# EAGLE schematic offical board (EAGLE 6.5.0)
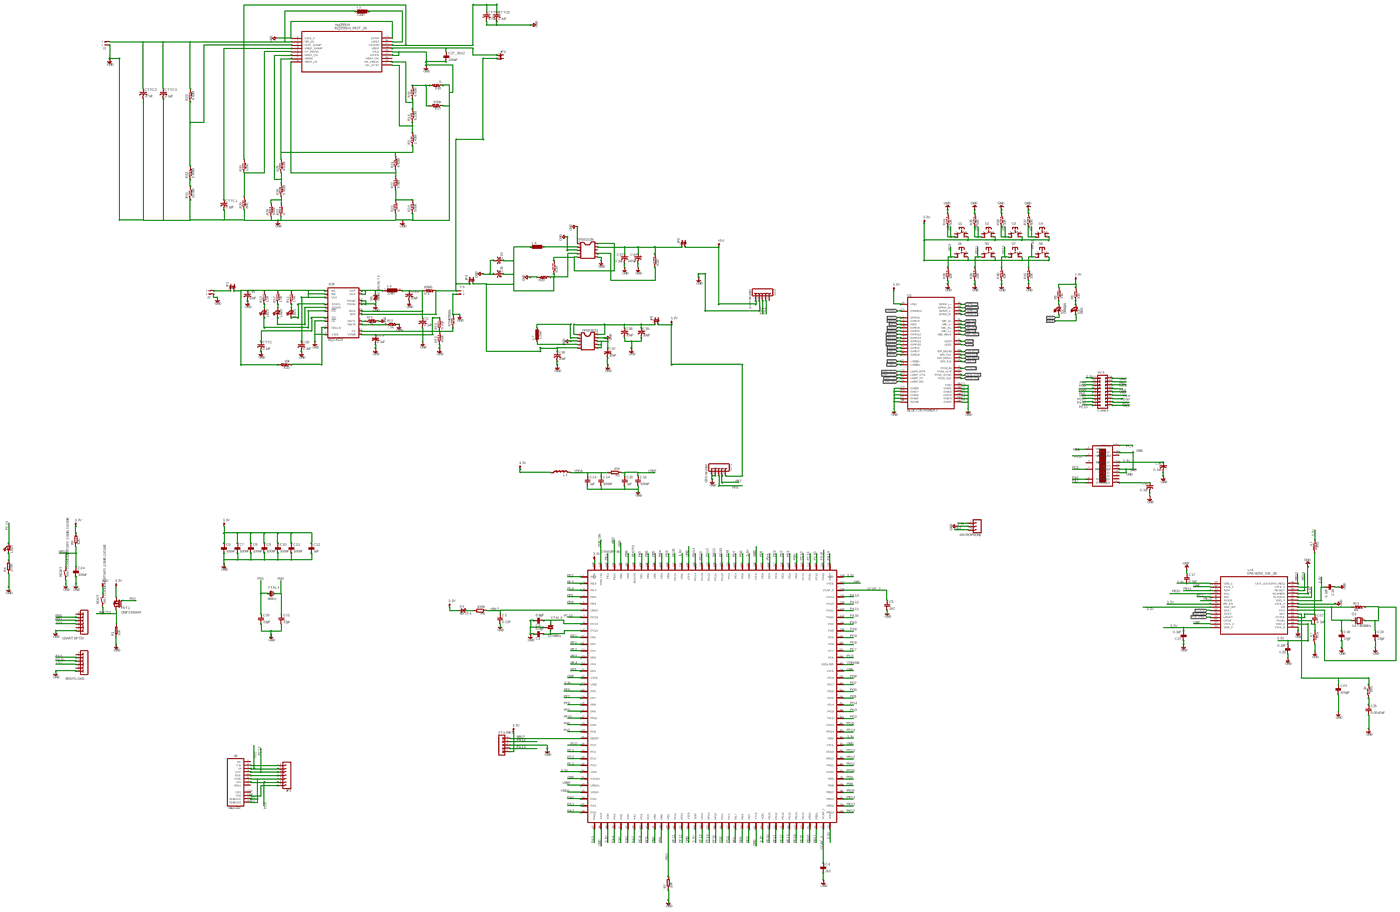
[diagram p0: schematic, sheet 1, overview]
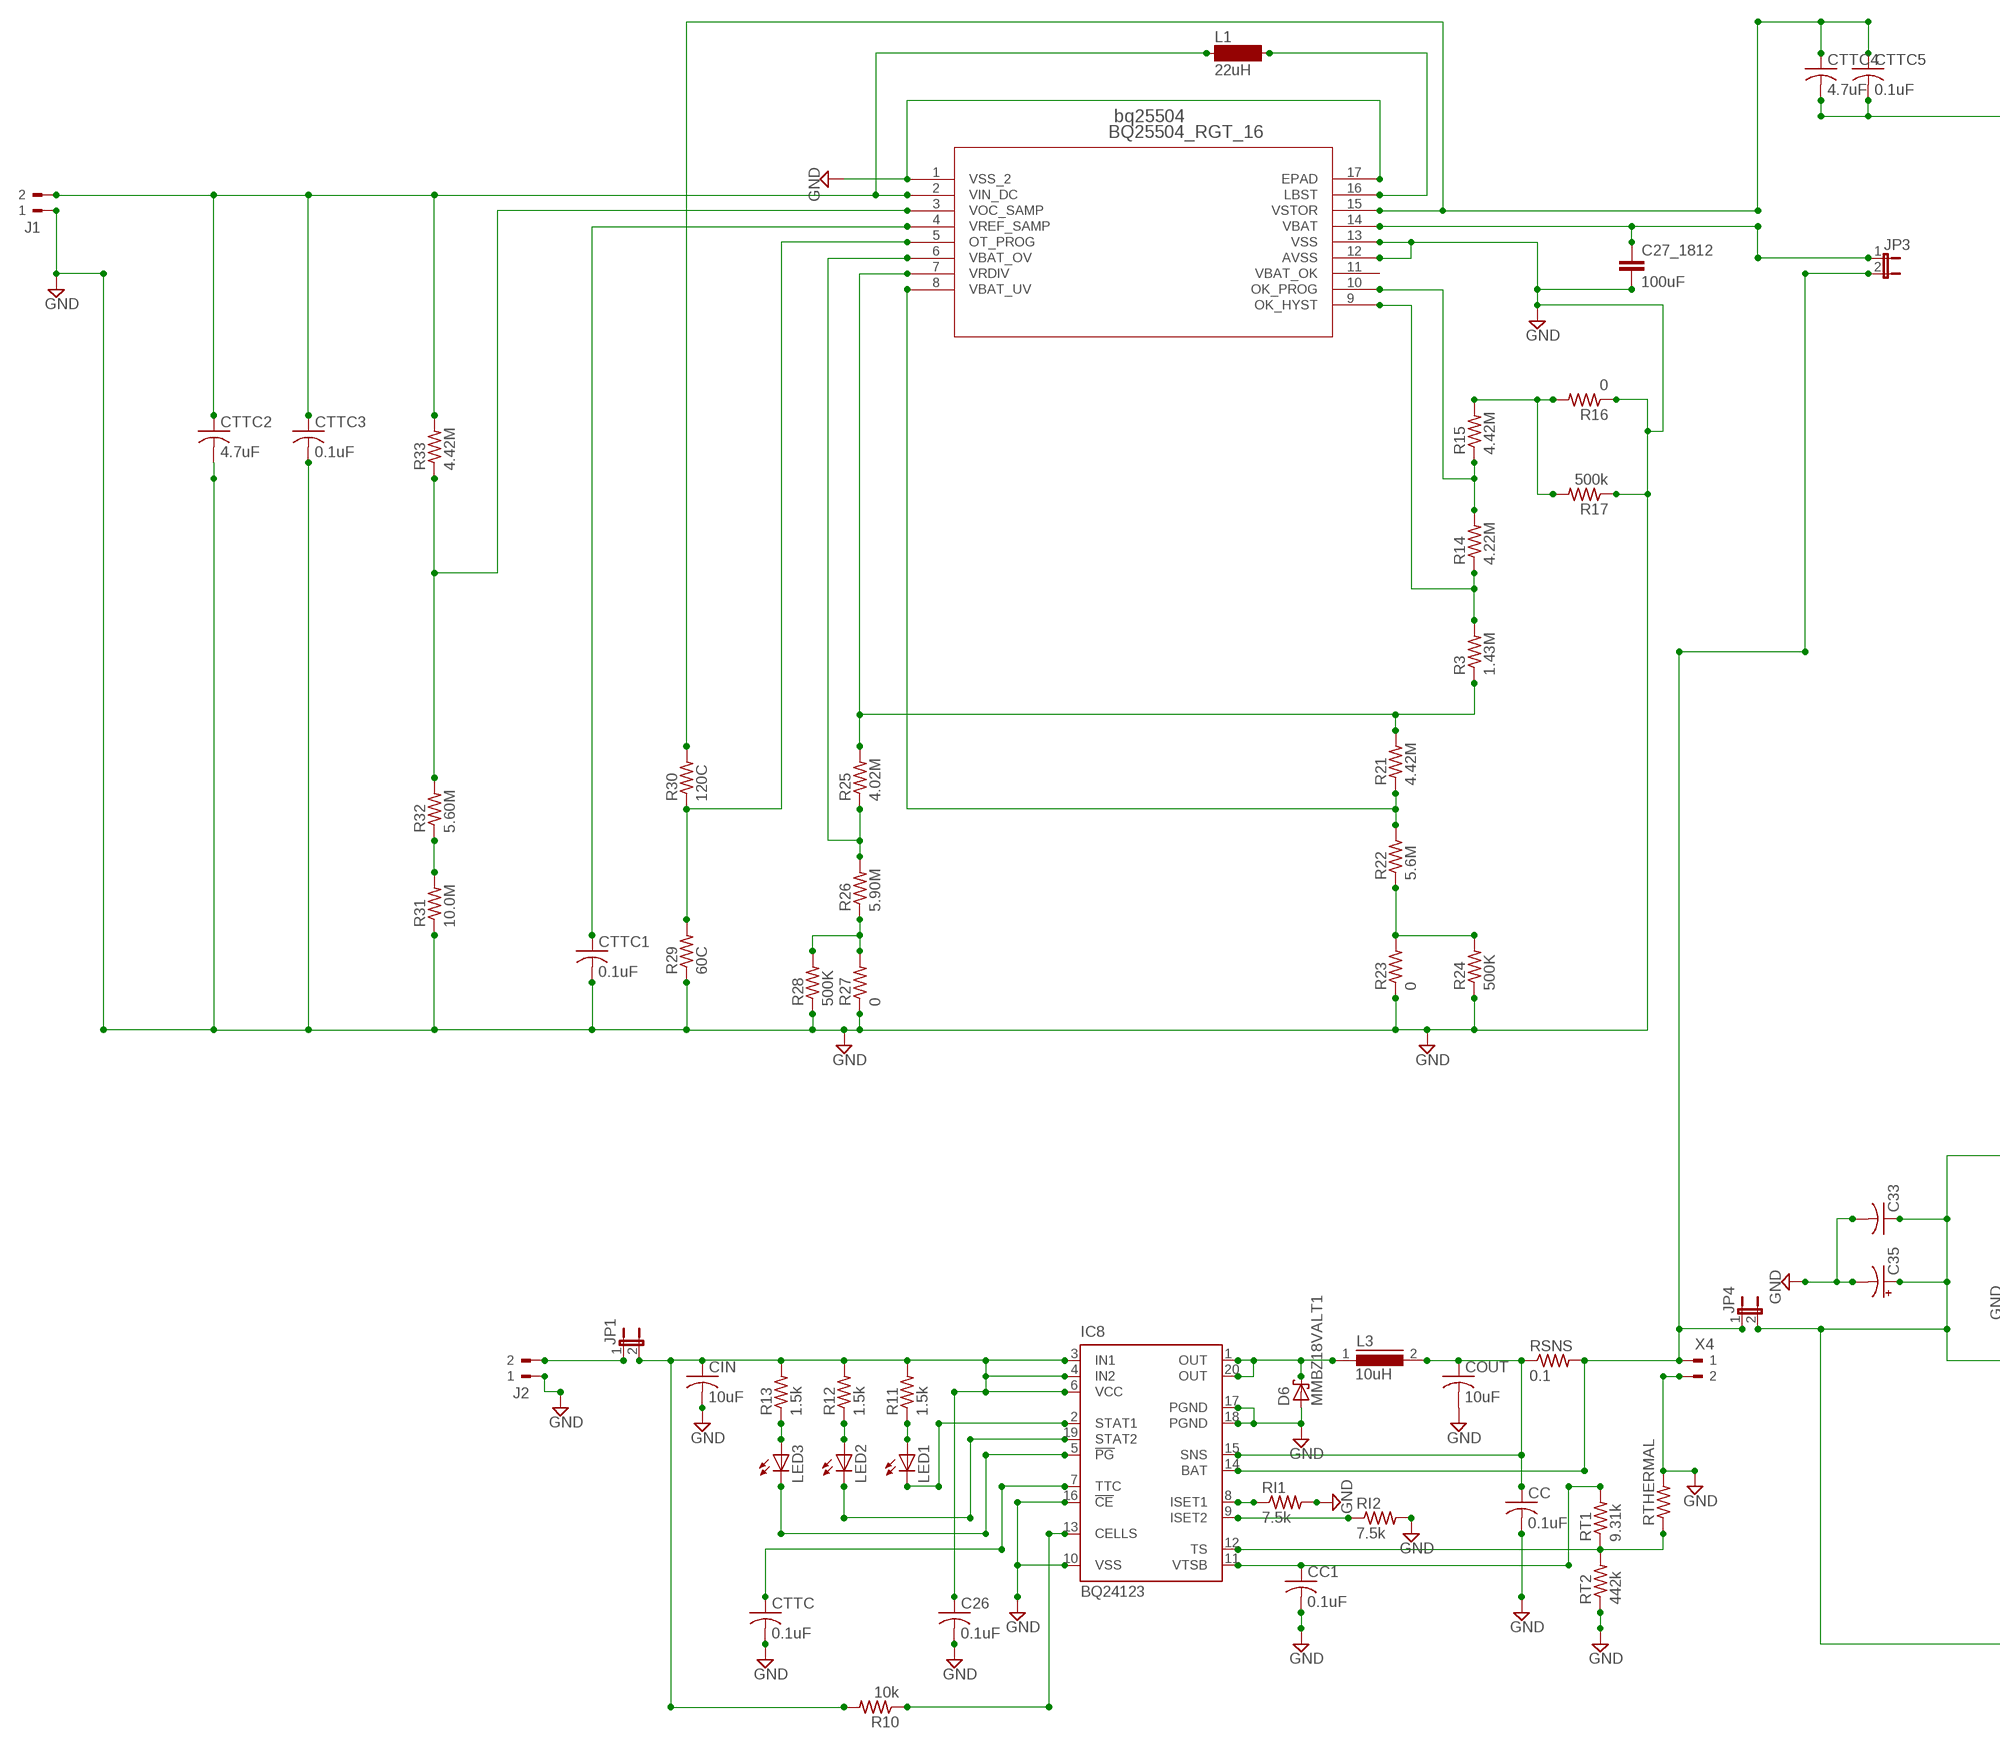
[diagram p1: schematic, sheet 1, part 1 of 5]
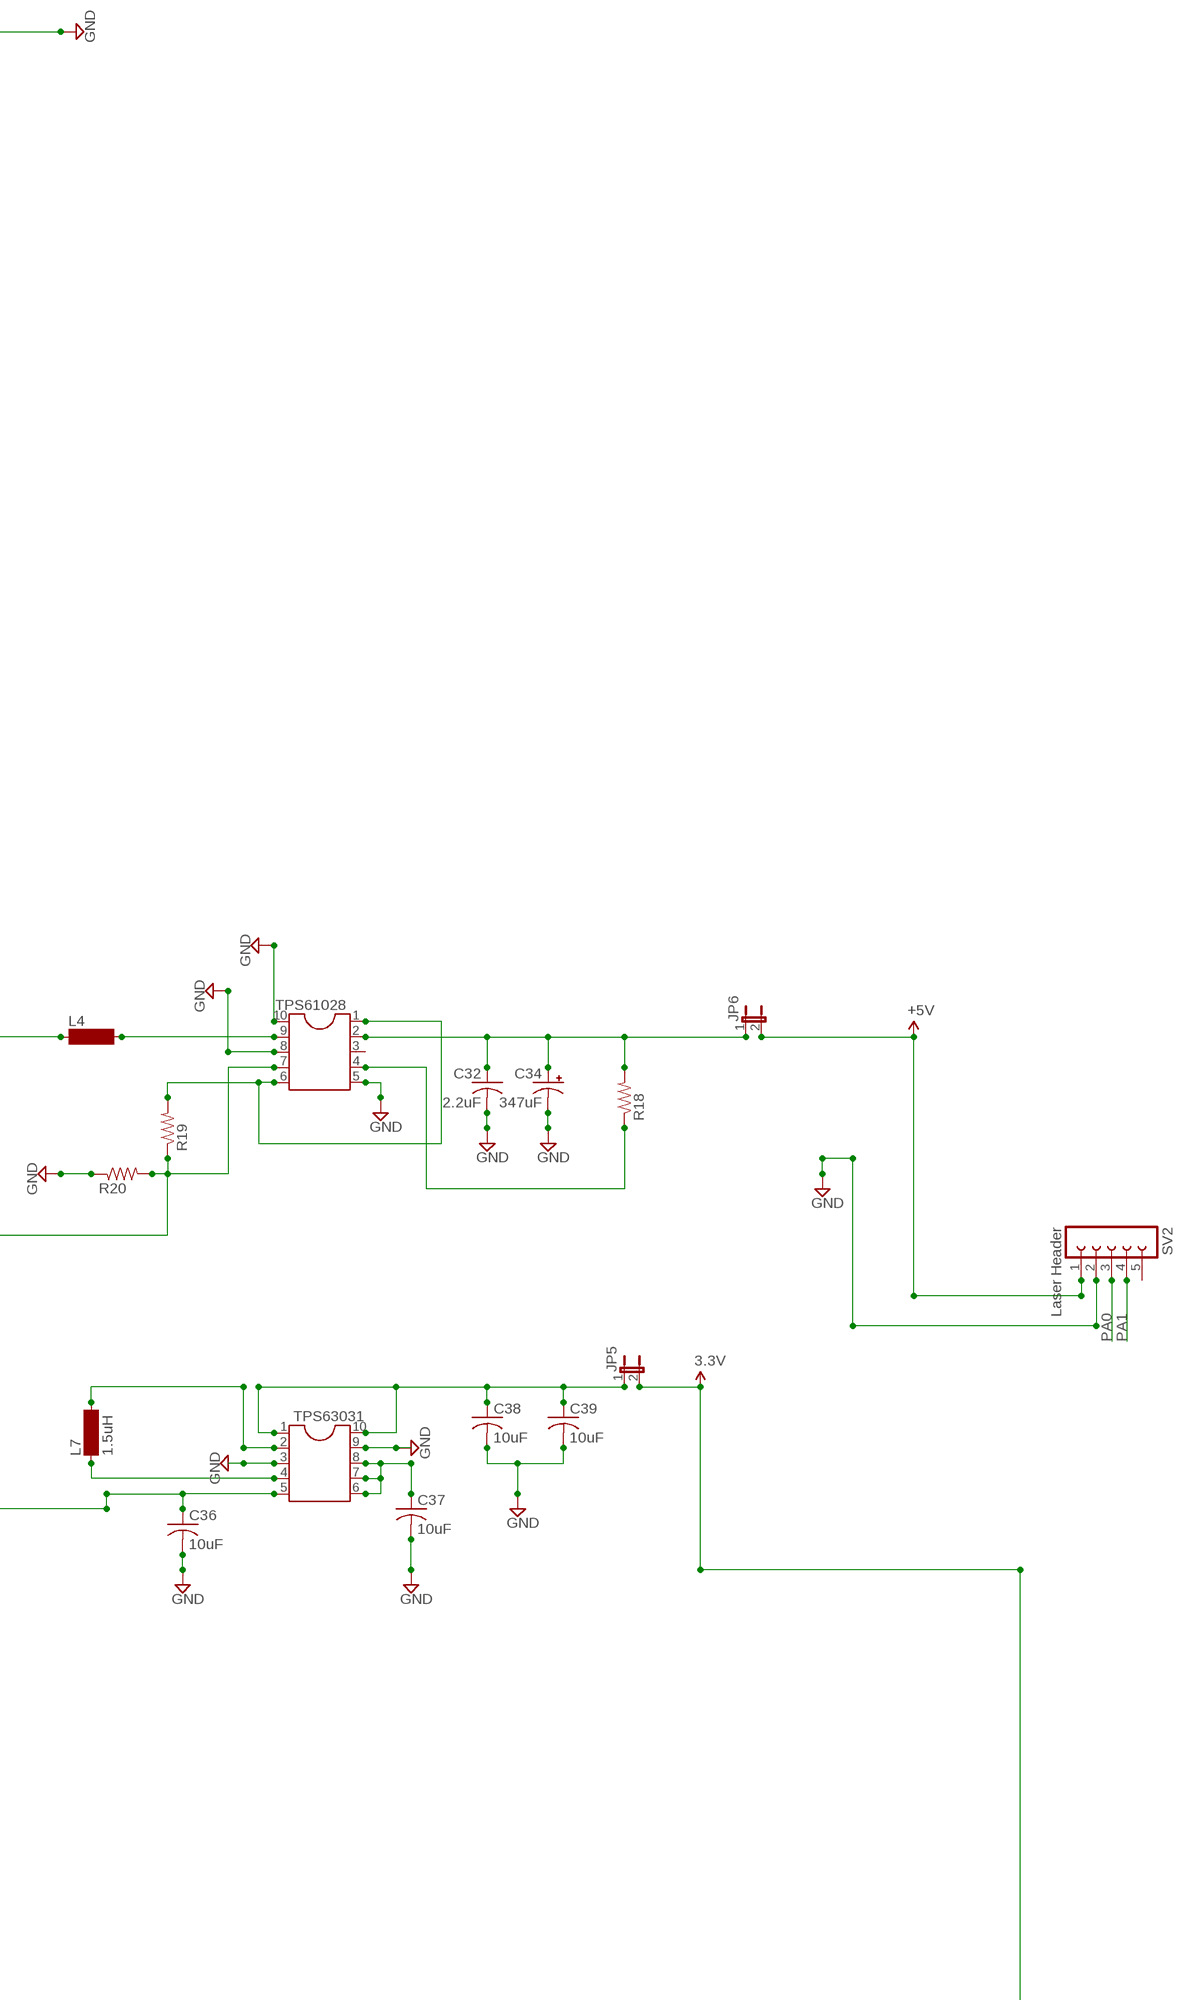
[diagram p2: schematic, sheet 1, part 2 of 5]
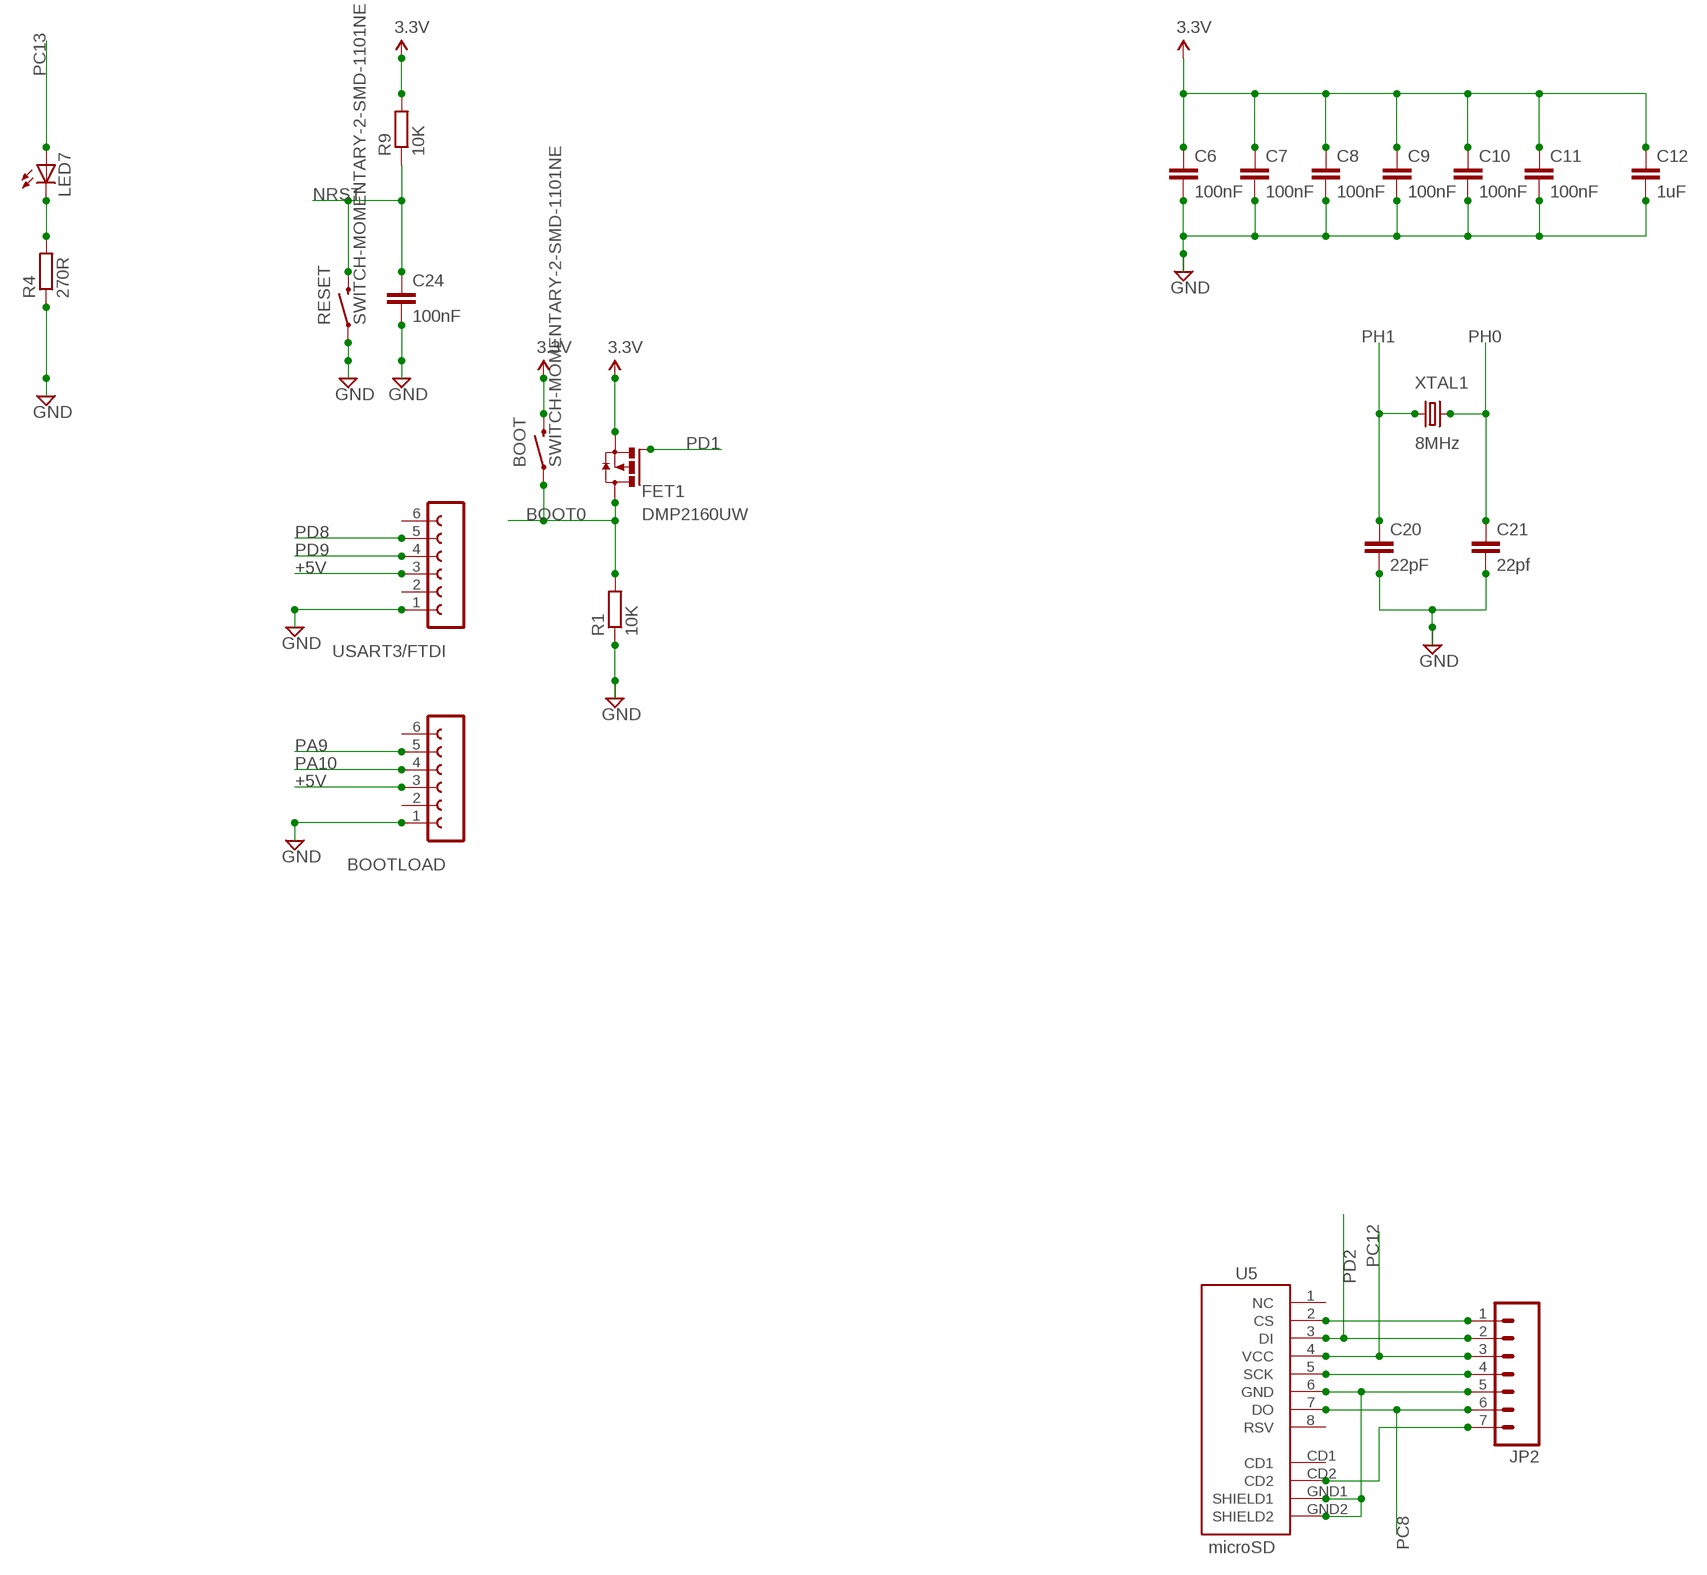
[diagram p3: schematic, sheet 1, part 3 of 5]
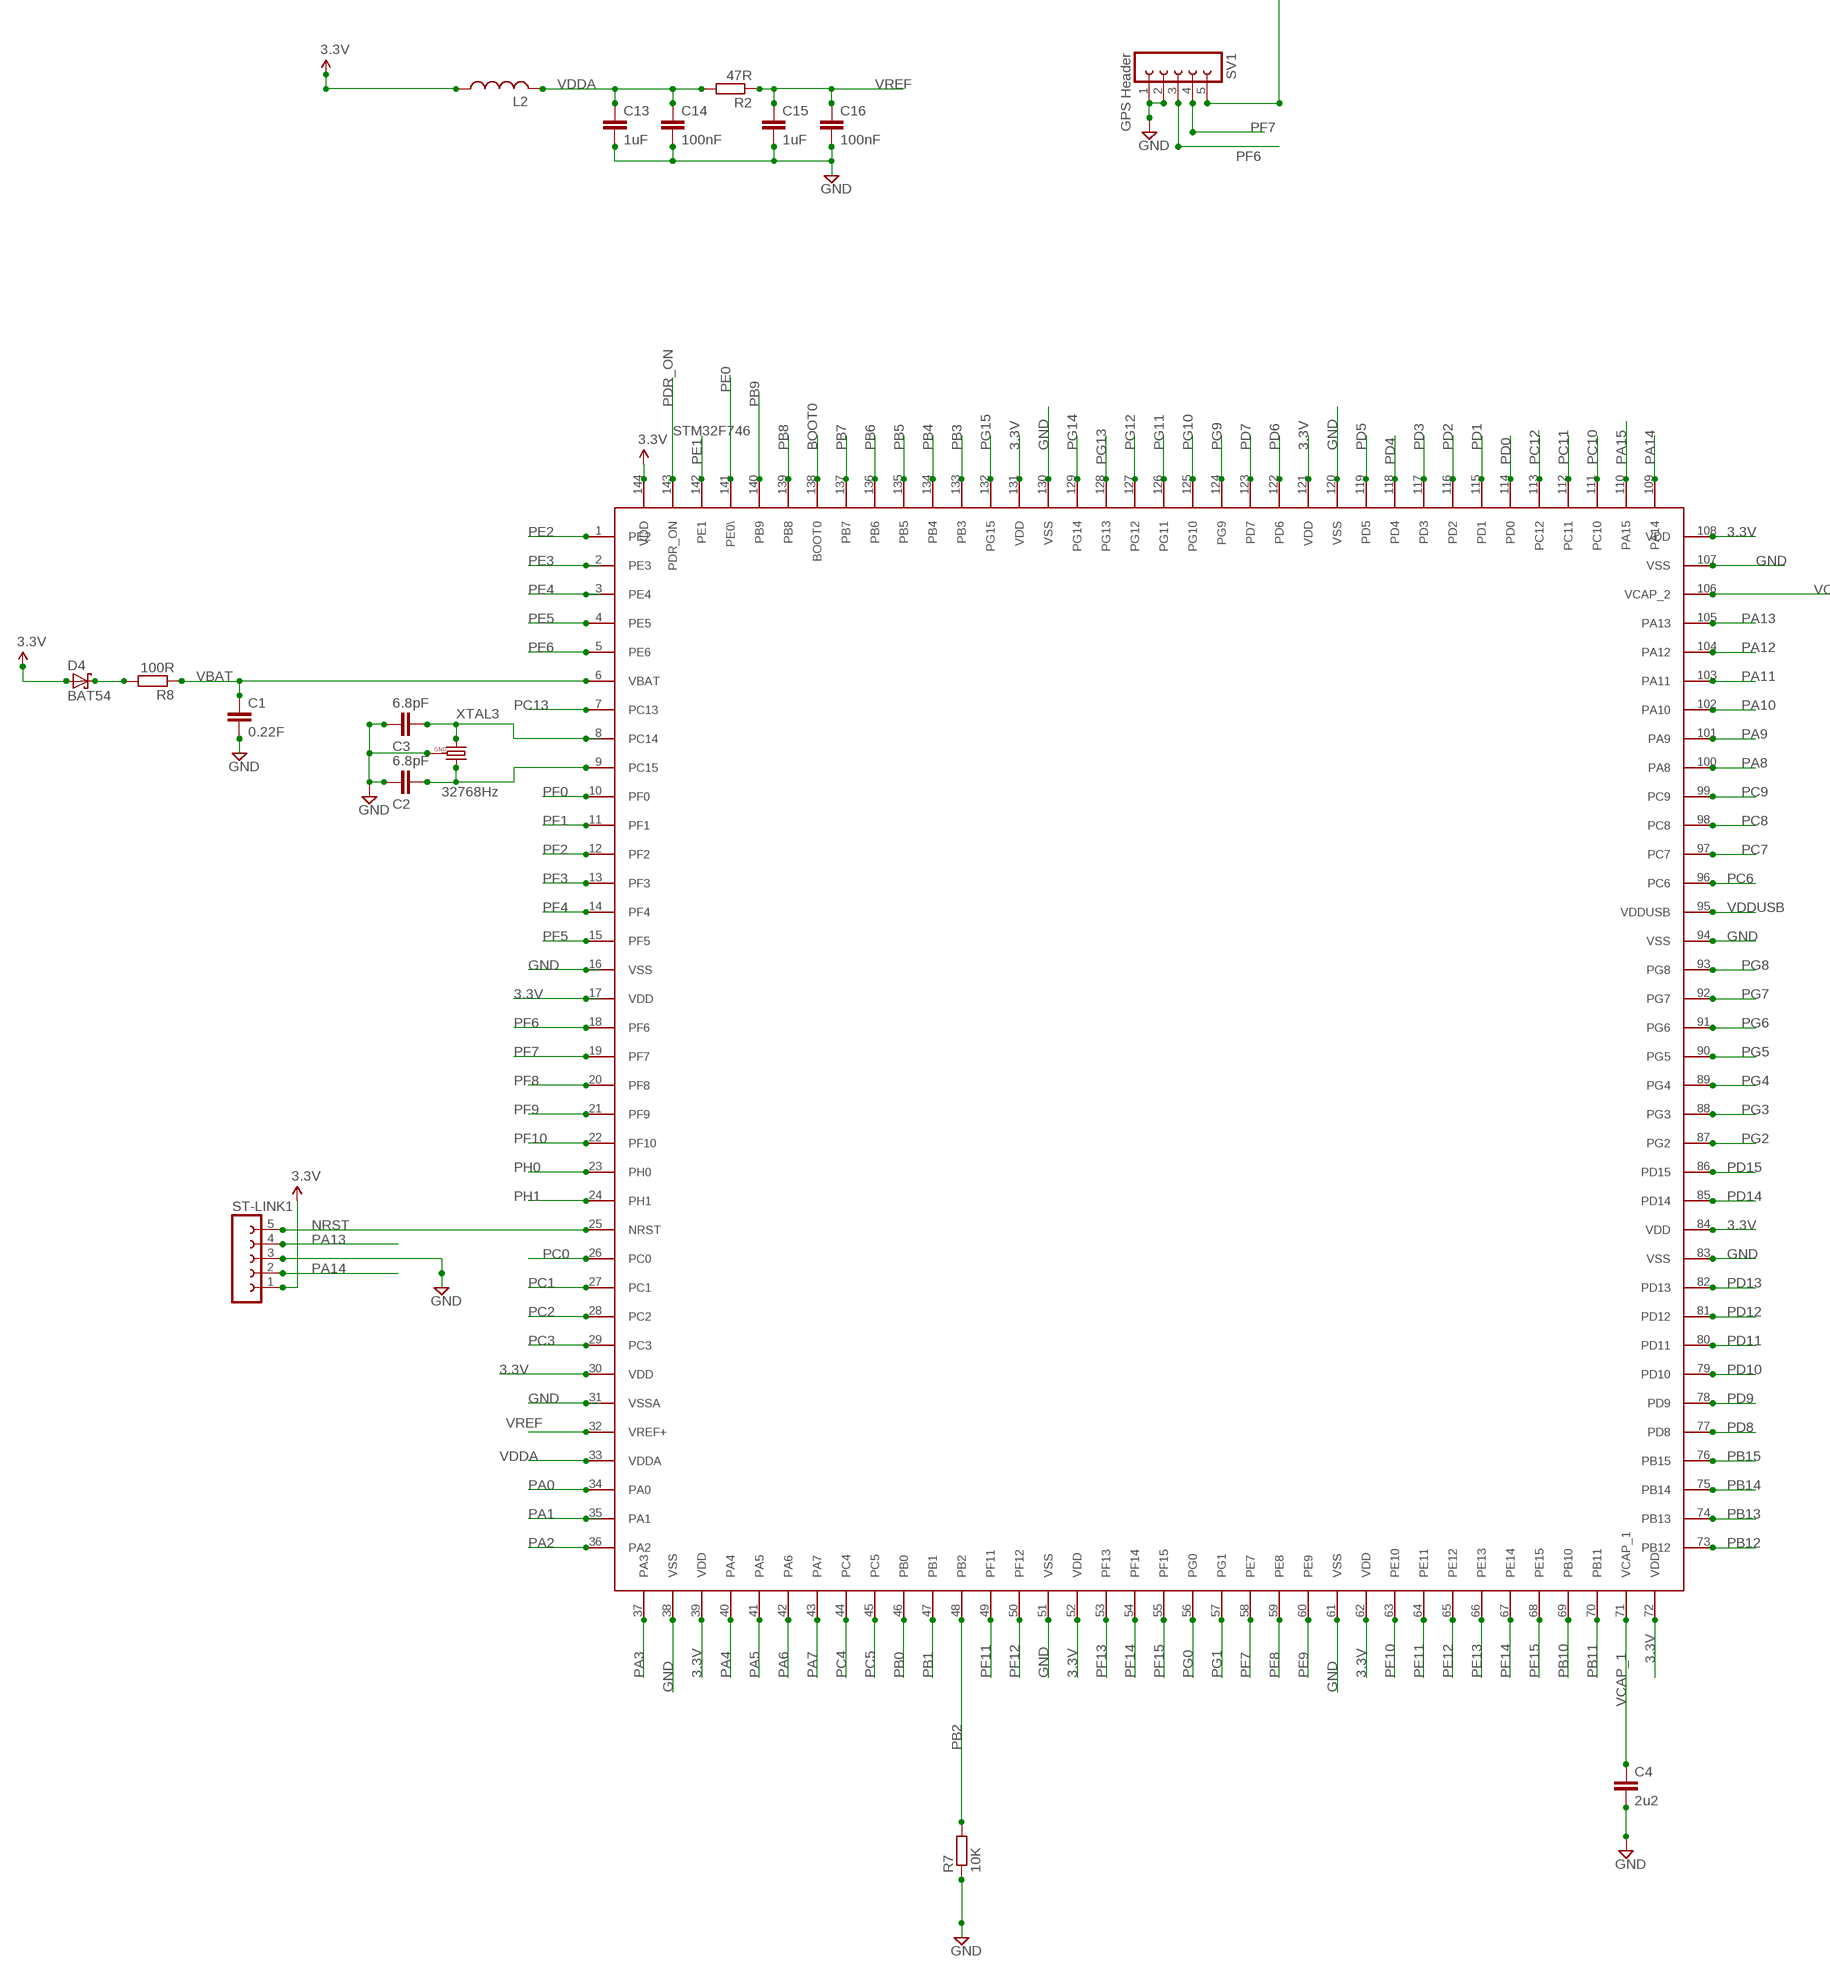
[diagram p4: schematic, sheet 1, part 4 of 5]
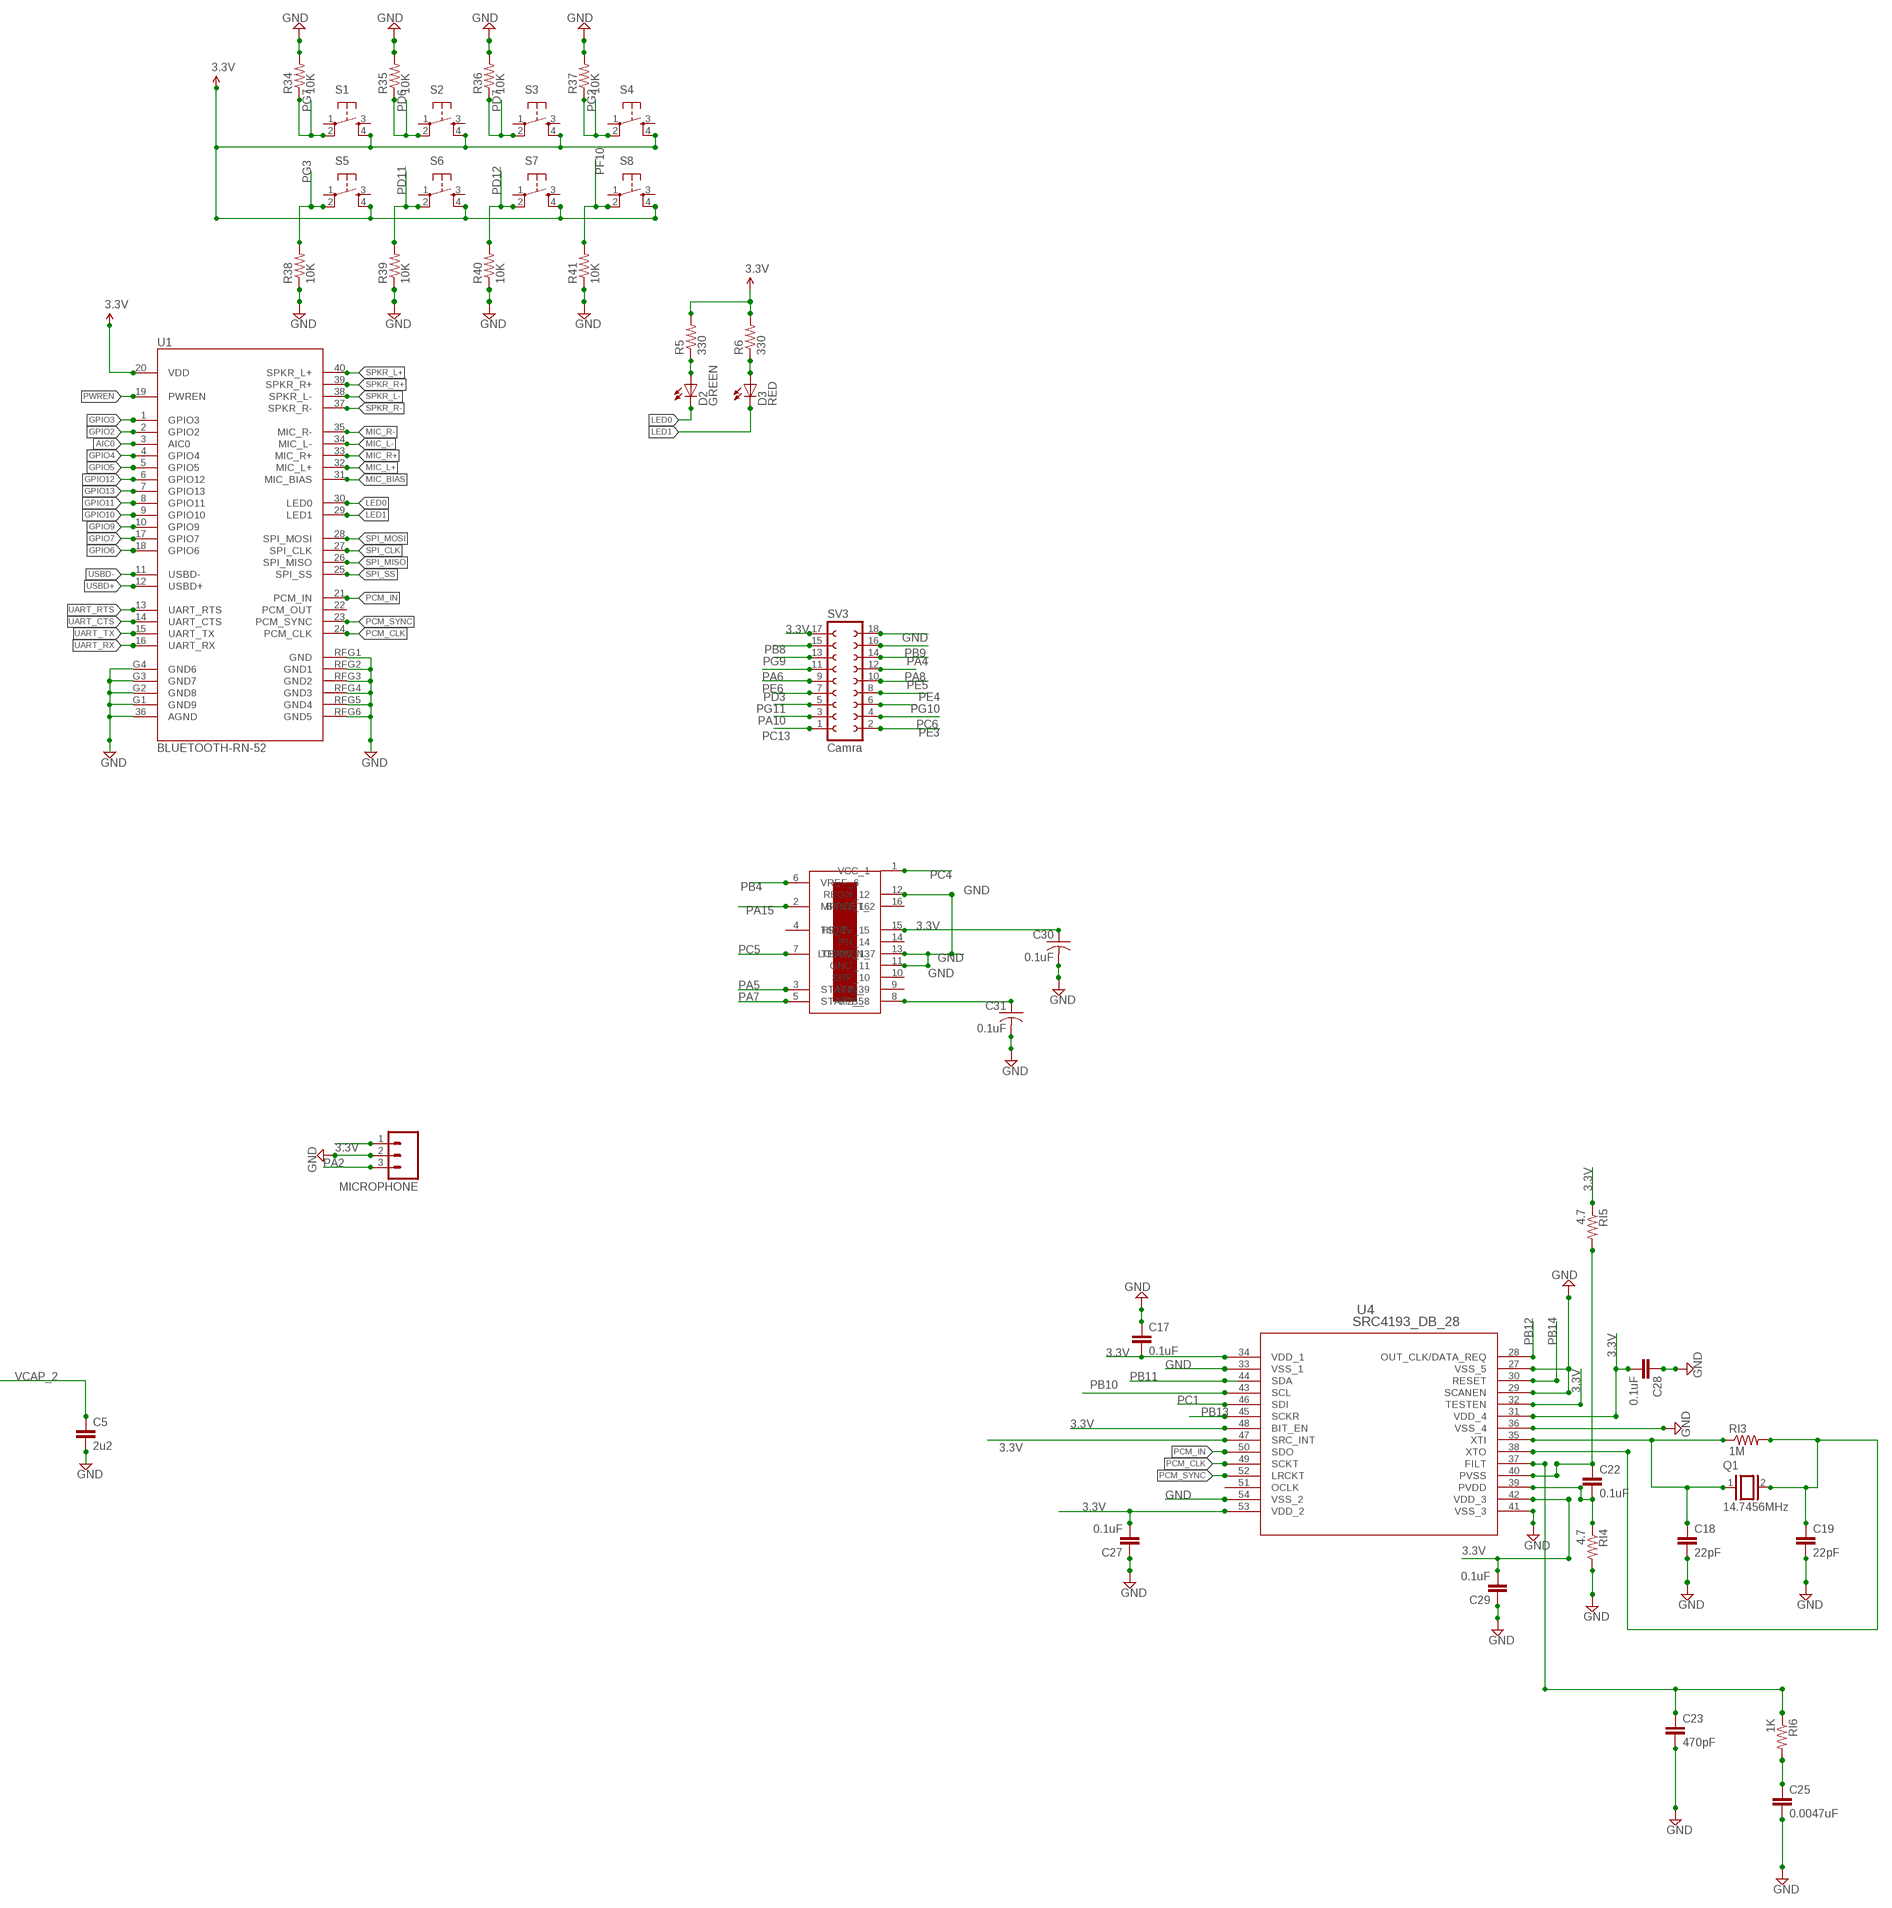
[diagram p5: schematic, sheet 1, part 5 of 5]

## Parts
BOOT  SWITCH-MOMENTARY-2-SMD-1101NE  [TACTILE-SWITCH-1101NE]
BOOTLOAD  FE06-1  [FE06]
C1  0.22F  C5/5  [C5B5]
C2  6.8pF  C-EUC0603  [C0603]
C3  6.8pF  C-EUC0603  [C0603]
C4  2u2  C-EUC0603  [C0603]
C5  2u2  C-EUC0603  [C0603]
C6  100nF  C-EUC0603  [C0603]
C7  100nF  C-EUC0603  [C0603]
C8  100nF  C-EUC0603  [C0603]
C9  100nF  C-EUC0603  [C0603]
C10  100nF  C-EUC0603  [C0603]
C11  100nF  C-EUC0603  [C0603]
C12  1uF  C-EUC0603  [C0603]
C13  1uF  C-EUC0603  [C0603]
C14  100nF  C-EUC0603  [C0603]
C15  1uF  C-EUC0603  [C0603]
C16  100nF  C-EUC0603  [C0603]
C17  0.1uF  C-EUC0603  [C0603]
C18  22pF  C-EUC0603  [C0603]
C19  22pF  C-EUC0603  [C0603]
C20  22pF  C-EUC0603  [C0603]
C21  22pf  C-EUC0603  [C0603]
C22  0.1uF  C-EUC0603  [C0603]
C23  470pF  C-EUC0603  [C0603]
C24  100nF  C-EUC0603  [C0603]
C25  0.0047uF  C-EUC0603  [C0603]
C26  0.1uF  C-USC0805  [C0805]
C27  0.1uF  C-EUC0603  [C0603]
C27_1812  100uF  C-EUC1812  [C1812]
C28  0.1uF  C-EUC0603  [C0603]
C29  0.1uF  C-EUC0603  [C0603]
C30  0.1uF  C-USC0603  [C0603]
C31  0.1uF  C-USC0603  [C0603]
C32  2.2uF  C-USC0603  [C0603]
C33  C-USC0603  [C0603]
C34  347uF  CPOL-US150CLZ-0810  [150CLZ-0810]
C35  CPOL-US150CLZ-0810  [150CLZ-0810]
C36  10uF  C-USC0603  [C0603]
C37  10uF  C-USC0603  [C0603]
C38  10uF  C-USC0603  [C0603]
C39  10uF  C-USC0603  [C0603]
CC  0.1uF  C-USC0805  [C0805]
CC1  0.1uF  C-USC0805  [C0805]
CIN  10uF  C-USC0805  [C0805]
COUT  10uF  C-USC0805  [C0805]
CTTC  0.1uF  C-USC0805  [C0805]
CTTC1  0.1uF  C-USC0805  [C0805]
CTTC2  4.7uF  C-USC0805  [C0805]
CTTC3  0.1uF  C-USC0805  [C0805]
CTTC4  4.7uF  C-USC0805  [C0805]
CTTC5  0.1uF  C-USC0805  [C0805]
D2  GREEN  LED-GREEN0603  [LED-0603]
D3  RED  LED-RED0603  [LED-0603]
D4  BAT54  [SOT23]
D6  MMBZ18VALT1  1N5908  [C4111-15]
FET1  DMP2160UW  FDN360P  [SUPER-SOT3]
IC8  BQ24123  [QFN20_3,5X4,5]
J1  90-2  [90-2]
J2  90-2  [90-2]
JP1  JP1E  [JP1]
JP2  M07  [1X07]
JP3  JP1E  [JP1]
JP4  JP1E  [JP1]
JP5  JP1E  [JP1]
JP6  JP1E  [JP1]
L1  22uH  SM-1206  [SM-1206]
L2  RCL_L-USL0603  [RCL_L0603]
L3  10uH  DR73  [DR73]
L4  SM-1206  [SM-1206]
L7  1.5uH  SM-1206  [SM-1206]
LED1  SFH482  [SFH482]
LED2  SFH482  [SFH482]
LED3  SFH482  [SFH482]
LED7  LEDCHIP-LED0603  [CHIP-LED0603]
MICROPHONE  M03PTH  [1X03]
Q1  14.7456MHz  XTAL/S  [QS]
R1  10K  R-EU_R0603  [R0603]
R2  47R  R-EU_R0603  [R0603]
R3  1.43M  R-US_R0805  [R0805]
R4  270R  R-EU_R0603  [R0603]
R5  330  RESISTOR0603-RES  [0603-RES]
R6  330  RESISTOR0603-RES  [0603-RES]
R7  10K  R-EU_R0603  [R0603]
R8  100R  R-EU_R0603  [R0603]
R9  10K  R-EU_R0603  [R0603]
R10  10k  R-US_R0805  [R0805]
R11  1.5k  R-US_R0805  [R0805]
R12  1.5k  R-US_R0805  [R0805]
R13  1.5k  R-US_R0805  [R0805]
R14  4.22M  R-US_R0805  [R0805]
R15  4.42M  R-US_R0805  [R0805]
R16  0  R-US_R0805  [R0805]
R17  500k  R-US_R0805  [R0805]
R18  R-US_R0603  [R0603]
R19  R-US_R0603  [R0603]
R20  R-US_R0603  [R0603]
R21  4.42M  R-US_R0805  [R0805]
R22  5.6M  R-US_R0805  [R0805]
R23  0  R-US_R0805  [R0805]
R24  500K  R-US_R0805  [R0805]
R25  4.02M  R-US_R0805  [R0805]
R26  5.90M  R-US_R0805  [R0805]
R27  0  R-US_R0805  [R0805]
R28  500K  R-US_R0805  [R0805]
R29  60C  R-US_R0805  [R0805]
R30  120C  R-US_R0805  [R0805]
R31  10.0M  R-US_R0805  [R0805]
R32  5.60M  R-US_R0805  [R0805]
R33  4.42M  R-US_R0805  [R0805]
R34  10K  RESISTOR0603-RES  [0603-RES]
R35  10K  RESISTOR0603-RES  [0603-RES]
R36  10K  RESISTOR0603-RES  [0603-RES]
R37  10K  RESISTOR0603-RES  [0603-RES]
R38  10K  RESISTOR0603-RES  [0603-RES]
R39  10K  RESISTOR0603-RES  [0603-RES]
R40  10K  RESISTOR0603-RES  [0603-RES]
R41  10K  RESISTOR0603-RES  [0603-RES]
RESET  SWITCH-MOMENTARY-2-SMD-1101NE  [TACTILE-SWITCH-1101NE]
RI1  7.5k  R-US_R0805  [R0805]
RI2  7.5k  R-US_R0805  [R0805]
RI3  1M  R-US_R0805  [R0805]
RI4  4.7  R-US_R0805  [R0805]
RI5  4.7  R-US_R0805  [R0805]
RI6  1K  R-US_R0805  [R0805]
RSNS  0.1  R-US_R1206  [R1206]
RT1  9.31k  R-US_R0805  [R0805]
RT2  442k  R-US_R0805  [R0805]
RTHERMAL  R-US_R0805  [R0805]
S1  TAC_SWITCHSMD  [TACTILE_SWITCH_SMD]
S2  TAC_SWITCHSMD  [TACTILE_SWITCH_SMD]
S3  TAC_SWITCHSMD  [TACTILE_SWITCH_SMD]
S4  TAC_SWITCHSMD  [TACTILE_SWITCH_SMD]
S5  TAC_SWITCHSMD  [TACTILE_SWITCH_SMD]
S6  TAC_SWITCHSMD  [TACTILE_SWITCH_SMD]
S7  TAC_SWITCHSMD  [TACTILE_SWITCH_SMD]
S8  TAC_SWITCHSMD  [TACTILE_SWITCH_SMD]
ST-LINK1  FE05-1  [FE05-1]
SV1  GPS Header  FE05-1  [FE05-1]
SV2  Laser Header  FE05-1  [FE05-1]
SV3  Camra  FE09-2  [FE09-2]
TPS61028  DIL10  [DIL10]
TPS63031  DIL10  [DIL10]
U1  BLUETOOTH-RN-52  [RN-52]
U3  BQ25504_RGT_16  [RGT16_1P7X1P7]
U4  SRC4193_DB_28  [DB28]
U5  microSD  USD-SOCKETSMD  [MICRO-SD-SOCKET-PP]
U$1  STM32F746  [QFN144]
U$2  QFN16  [QFN16]
USART3/FTDI  FE06-1  [FE06]
X4  90-2  [90-2]
XTAL1  8MHz  CRYSTALHC49U-V  [HC49U-V]
XTAL3  32768Hz  CRYSTAL_Q_GNDS  [CRYSTAL_TC26H_3_REPAIR_SMD_SMALL_PITCH]

## Nets
3.3V [thin_power]: BOOT.P$2 C6.1 C7.1 C8.1 C9.1 C10.1 C11.1 C12.1 C17.2 C27.2 C28.2 C29.2 C30.1 D4.1(A) FET1.2(S) JP5.2 L2.1 MICROPHONE.1 R5.2 R6.2 R9.2 RI5.1 S1.4 S2.4 S3.4 S4.4 S5.4 S6.4 S7.4 S8.4 ST-LINK1.1 SV1.5 SV3.17 U1.20(VDD) U4.31(VDD_4) U4.32(TESTEN) U4.34(VDD_1) U4.42(VDD_3) U4.47(SRC_INT) U4.48(BIT_EN) U4.53(VDD_2) U$1.17(VDD) U$1.30(VDD) U$1.39(VDD) U$1.52(VDD) U$1.62(VDD) U$1.72(VDD) U$1.84(VDD) U$1.108(VDD) U$1.121(VDD) U$1.131(VDD) U$1.144(VDD) U$2.15(HIDRV_15)
+5V [power usb]: BOOTLOAD.3 JP6.2 SV2.1 USART3/FTDI.3
AIC0: U1.3(AIC0)
BOOT0: BOOT.P$1 FET1.3(D) R1.2 U$1.138(BOOT0)
CD2: JP2.7 U5.CD2
CS1: JP2.1 U5.2(CS)
GND: BOOTLOAD.1 C1.2 C2.2 C3.2 C4.2 C5.2 C6.2 C7.2 C8.2 C9.2 C10.2 C11.2 C12.2 C13.2 C14.2 C15.2 C16.2 C17.1 C18.2 C19.2 C20.2 C21.2 C23.2 C24.2 C25.2 C26.2 C27.1 C27_1812.2 C28.1 C29.1 C30.2 C31.2 C32.2 C33.2 C34.- C35.- C36.2 C37.2 C38.2 C39.2 CC1.2 CC.2 CIN.2 COUT.2 CTTC1.2 CTTC2.2 CTTC3.2 CTTC4.2 CTTC5.2 CTTC.2 D6.A IC8.10(VSS) IC8.16(!CE) IC8.17(PGND) IC8.18(PGND) J1.1 J2.1 MICROPHONE.2 R1.1 R4.1 R7.1 R16.1 R17.1 R20.1 R23.1 R24.1 R27.1 R28.1 R29.1 R31.1 R34.2 R35.2 R36.2 R37.2 R38.1 R39.1 R40.1 R41.1 RESET.P$1 RI1.2 RI2.2 RI4.2 RT2.1 RTHERMAL.2 ST-LINK1.3 SV1.1 SV1.2 SV2.2 SV3.18 TPS61028.5 TPS61028.8 TPS61028.10 TPS63031.3 TPS63031.9 U1.36(AGND) U1.G1(GND9) U1.G2(GND8) U1.G3(GND7) U1.G4(GND6) U1.RFG1(GND) U1.RFG2(GND1) U1.RFG3(GND2) U1.RFG4(GND3) U1.RFG5(GND4) U1.RFG6(GND5) U3.1(VSS_2) U3.12(AVSS) U3.13(VSS) U3.17(EPAD) U4.27(VSS_5) U4.29(SCANEN) U4.33(VSS_1) U4.36(VSS_4) U4.41(VSS_3) U4.54(VSS_2) U$1.16(VSS) U$1.31(VSSA) U$1.38(VSS) U$1.51(VSS) U$1.61(VSS) U$1.83(VSS) U$1.94(VSS) U$1.107(VSS) U$1.120(VSS) U$1.130(VSS) U$2.11(GND_11) U$2.12(REGN_12) U$2.13(LODRV_13) USART3/FTDI.1 X4.2 XTAL3.GND
GND2: JP2.5 U5.6(GND) U5.GND1(SHIELD1) U5.GND2(SHIELD2)
GPIO2: U1.2(GPIO2)
GPIO3: U1.1(GPIO3)
GPIO4: U1.4(GPIO4)
GPIO5: U1.5(GPIO5)
GPIO6: U1.18(GPIO6)
GPIO7: U1.17(GPIO7)
GPIO9: U1.10(GPIO9)
GPIO10: U1.9(GPIO10)
GPIO11: U1.8(GPIO11)
GPIO12: U1.6(GPIO12)
GPIO13: U1.7(GPIO13)
LED0: D2.C U1.30(LED0)
LED1: D3.C U1.29(LED1)
MIC_BIAS: U1.31(MIC_BIAS)
MIC_L+: U1.32(MIC_L+)
MIC_L-: U1.34(MIC_L-)
MIC_R+: U1.33(MIC_R+)
MIC_R-: U1.35(MIC_R-)
N$1: D3.A R6.1
N$2: D2.A R5.1
N$3: D4.3(C) R8.2
N$4: C33.1 C35.+ C36.1 JP4.2 L4.1 R19.1 R20.2 TPS61028.7 TPS63031.5
N$5: C18.1 Q1.1 RI3.1 U4.35(XTI)
N$6: D6.C IC8.1(OUT) IC8.20(OUT) L3.1
N$7: C23.1 RI6.1 U4.37(FILT)
N$8 [power usb]: J2.2 JP1.1
N$9: C19.1 Q1.2 RI3.2 U4.38(XTO)
N$10: CTTC2.1 CTTC3.1 J1.2 L1.1 R33.2 U3.2(VIN_DC)
N$11: C25.1 RI6.2
N$12: CC.1 COUT.1 IC8.15(SNS) L3.2 RSNS.1
N$13: C22.2 RI4.1 U4.39(PVDD)
N$14: C22.1 RI5.2 U4.40(PVSS)
N$15: C27_1812.1 JP3.1 U3.14(VBAT)
N$16: CTTC4.1 CTTC5.1 R30.2 U3.15(VSTOR)
N$17: IC8.14(BAT) JP3.2 JP4.1 RSNS.2 X4.1
N$18: IC8.8(ISET1) RI1.1
N$19: R14.2 R15.1 U3.10(OK_PROG)
N$20: R3.2 R14.1 U3.9(OK_HYST)
N$21: IC8.9(ISET2) RI2.1
N$22: IC8.12(TS) RT1.1 RT2.2 RTHERMAL.1
N$23: CC1.1 IC8.11(VTSB) RT1.2
N$24: LED3.A R13.1
N$25: LED2.A R12.1
N$26: LED1.A R11.1
N$27: IC8.2(STAT1) LED1.K(C)
N$28: IC8.19(STAT2) LED2.K(C)
N$29: IC8.5(!PG) LED3.K(C)
N$30: CTTC.1 IC8.7(TTC)
N$31: IC8.13(CELLS) R10.1
N$32: R15.2 R16.2 R17.2
N$33: R3.1 R21.2 R25.2 U3.7(VRDIV)
N$34: R21.1 R22.2 U3.8(VBAT_UV)
N$35: R22.1 R23.2 R24.2
N$36 [thin_power]: C38.1 C39.1 JP5.1 TPS63031.1 TPS63031.10
N$37: C26.1 CIN.1 IC8.3(IN1) IC8.4(IN2) IC8.6(VCC) JP1.2 R10.2 R11.2 R12.2 R13.2
N$38: C31.1 U$2.8(VFB_8)
N$39: L1.2 U3.16(LBST)
N$40: R25.1 R26.2 U3.6(VBAT_OV)
N$41: R26.1 R27.2 R28.2
N$42: CTTC1.1 U3.4(VREF_SAMP)
N$43 [power usb]: C32.1 C34.+ JP6.1 R18.2 TPS61028.2
N$44: R18.1 TPS61028.4
N$45: R19.2 TPS61028.1 TPS61028.6
N$46: R29.2 R30.1 U3.5(OT_PROG)
N$47: L4.2 TPS61028.9
N$49: L7.2 TPS63031.2
N$50: L7.1 TPS63031.4
N$51: C37.1 TPS63031.6 TPS63031.7 TPS63031.8
N$52: R31.2 R32.1
N$53: R32.2 R33.1 U3.3(VOC_SAMP)
N$57: LED7.C R4.2
NRST: C24.1 R9.1 RESET.P$2 ST-LINK1.5 U$1.25(NRST)
PA0: SV2.3 U$1.34(PA0)
PA1: SV2.4 U$1.35(PA1)
PA2: MICROPHONE.3 U$1.36(PA2)
PA3: U$1.37(PA3)
PA4: SV3.14 U$1.40(PA4)
PA5: U$1.41(PA5) U$2.3(STAT1_3)
PA6: SV3.11 U$1.42(PA6)
PA7: U$1.43(PA7) U$2.5(STAT2_5)
PA8: SV3.12 U$1.100(PA8)
PA9: BOOTLOAD.5 U$1.101(PA9)
PA10: BOOTLOAD.4 SV3.3 U$1.102(PA10)
PA11: U$1.103(PA11)
PA12: U$1.104(PA12)
PA13: ST-LINK1.4 U$1.105(PA13)
PA14: ST-LINK1.2 U$1.109(PA14)
PA15: U$1.110(PA15) U$2.2(MPPSET_2)
PB0: U$1.46(PB0)
PB1: U$1.47(PB1)
PB2: R7.2 U$1.48(PB2)
PB3: U$1.133(PB3)
PB4: U$1.134(PB4) U$2.6(VREF_6)
PB5: U$1.135(PB5)
PB6: U$1.136(PB6)
PB7: U$1.137(PB7)
PB8: SV3.15 U$1.139(PB8)
PB9: SV3.16 U$1.140(PB9)
PB10: U4.43(SCL) U$1.69(PB10)
PB11: U4.44(SDA) U$1.70(PB11)
PB12: U4.28(OUT_CLK/DATA_REQ) U$1.73(PB12)
PB13: U4.45(SCKR) U$1.74(PB13)
PB14: U4.30(RESET) U$1.75(PB14)
PB15: U$1.76(PB15)
PC0: U$1.26(PC0)
PC1: U4.46(SDI) U$1.27(PC1)
PC2: U$1.28(PC2)
PC3: U$1.29(PC3)
PC4: U$1.44(PC4) U$2.1(VCC_1)
PC5: U$1.45(PC5) U$2.7(TERMEN_7)
PC6: SV3.4 U$1.96(PC6)
PC7: U$1.97(PC7)
PC8: JP2.6 U5.7(DO) U$1.98(PC8)
PC9: U$1.99(PC9)
PC10: U$1.111(PC10)
PC11: U$1.112(PC11)
PC12: JP2.3 U5.4(VCC) U$1.113(PC12)
PC13: LED7.A SV3.1 U$1.7(PC13)
PC14: C3.1 U$1.8(PC14) XTAL3.1
PC15: C2.1 U$1.9(PC15) XTAL3.2
PCM_CLK: U1.24(PCM_CLK) U4.49(SCKT)
PCM_IN: U1.21(PCM_IN) U4.50(SDO)
PCM_SYNC: U1.23(PCM_SYNC) U4.52(LRCKT)
PD0: U$1.114(PD0)
PD1: FET1.1(G) U$1.115(PD1)
PD2: JP2.2 U5.3(DI) U$1.116(PD2)
PD3: SV3.7 U$1.117(PD3)
PD4: U$1.118(PD4)
PD5: U$1.119(PD5)
PD6: R35.1 S2.2 U$1.122(PD6)
PD7: R36.1 S3.2 U$1.123(PD7)
PD8: U$1.77(PD8) USART3/FTDI.5
PD9: U$1.78(PD9) USART3/FTDI.4
PD10: U$1.79(PD10)
PD11: R39.2 S6.2 U$1.80(PD11)
PD12: R40.2 S7.2 U$1.81(PD12)
PD13: U$1.82(PD13)
PD14: U$1.85(PD14)
PD15: U$1.86(PD15)
PDR_ON: U$1.143(PDR_ON)
PE0: U$1.141(PE0\)
PE1: U$1.142(PE1)
PE2: U$1.1(PE2)
PE3: SV3.2 U$1.2(PE3)
PE4: SV3.8 U$1.3(PE4)
PE5: SV3.10 U$1.4(PE5)
PE6: SV3.9 U$1.5(PE6)
PE7: U$1.58(PE7)
PE8: U$1.59(PE8)
PE9: U$1.60(PE9)
PE10: U$1.63(PE10)
PE11: U$1.64(PE11)
PE12: U$1.65(PE12)
PE13: U$1.66(PE13)
PE14: U$1.67(PE14)
PE15: U$1.68(PE15)
PF0: U$1.10(PF0)
PF1: U$1.11(PF1)
PF2: U$1.12(PF2)
PF3: U$1.13(PF3)
PF4: U$1.14(PF4)
PF5: U$1.15(PF5)
PF6: SV1.3 U$1.18(PF6)
PF7: SV1.4 U$1.19(PF7)
PF8: U$1.20(PF8)
PF9: U$1.21(PF9)
PF10: R41.2 S8.2 U$1.22(PF10)
PF11: U$1.49(PF11)
PF12: U$1.50(PF12)
PF13: U$1.53(PF13)
PF14: U$1.54(PF14)
PF15: U$1.55(PF15)
PG0: U$1.56(PG0)
PG1: U$1.57(PG1)
PG2: R37.1 S4.2 U$1.87(PG2)
PG3: R38.2 S5.2 U$1.88(PG3)
PG4: U$1.89(PG4)
PG5: U$1.90(PG5)
PG6: U$1.91(PG6)
PG7: R34.1 S1.2 U$1.92(PG7)
PG8: U$1.93(PG8)
PG9: SV3.13 U$1.124(PG9)
PG10: SV3.6 U$1.125(PG10)
PG11: SV3.5 U$1.126(PG11)
PG12: U$1.127(PG12)
PG13: U$1.128(PG13)
PG14: U$1.129(PG14)
PG15: U$1.132(PG15)
PH0: C21.1 U$1.23(PH0) XTAL1.2
PH1: C20.1 U$1.24(PH1) XTAL1.1
PWREN: U1.19(PWREN)
SCK1: JP2.4 U5.5(SCK)
SPI_CLK: U1.27(SPI_CLK)
SPI_MISO: U1.26(SPI_MISO)
SPI_MOSI: U1.28(SPI_MOSI)
SPI_SS: U1.25(SPI_SS)
SPKR_L+: U1.40(SPKR_L+)
SPKR_L-: U1.38(SPKR_L-)
SPKR_R+: U1.39(SPKR_R+)
SPKR_R-: U1.37(SPKR_R-)
UART_CTS: U1.14(UART_CTS)
UART_RTS: U1.13(UART_RTS)
UART_RX: U1.16(UART_RX)
UART_TX: U1.15(UART_TX)
USBD+: U1.12(USBD+)
USBD-: U1.11(USBD-)
VBAT: C1.1 R8.1 U$1.6(VBAT)
VCAP_1: C4.1 U$1.71(VCAP_1)
VCAP_2: C5.1 U$1.106(VCAP_2)
VDDA: C13.1 C14.1 L2.2 R2.2 U$1.33(VDDA)
VDDUSB: U$1.95(VDDUSB)
VREF: C15.1 C16.1 R2.1 U$1.32(VREF+)
Unconnected: BOOTLOAD.2 BOOTLOAD.6 IC8.EXP IC8.EXP@1 IC8.EXP@2 IC8.EXP@3 IC8.EXP@4 IC8.EXP@5 IC8.EXP@6 IC8.EXP@7 IC8.EXP@8 IC8.EXP@9 IC8.EXP@10 IC8.EXP@11 IC8.EXP@12 S1.1 S1.3 S2.1 S2.3 S3.1 S3.3 S4.1 S4.3 S5.1 S5.3 S6.1 S6.3 S7.1 S7.3 S8.1 S8.3 SV2.5 TPS61028.3 U1.22(PCM_OUT) U3.11(VBAT_OK) U4.51(OCLK) U5.1(NC) U5.8(RSV) U5.CD1 U$2.4(TS_4) U$2.9(SRN_9) U$2.10(SRP_10) U$2.14(PH_14) U$2.16(BTST_16) USART3/FTDI.2 USART3/FTDI.6

## Library data of the parts
BOOT RESET = SparkFun-Electromechanical:SWITCH-MOMENTARY-2: Various NO switches- pushbuttons, reed, etc
BOOTLOAD USART3/FTDI = con-lsta:FE06-1: FEMALE HEADER; OC_FARNELL: unknown; OC_NEWARK: unknown
C1 = capacitor-wima:C: CAPACITOR naming: grid - package width
C2-C25 C27-C29 = rcl:C-EU: CAPACITOR, European symbol
C26 C30-C33 C36-C39 CC CC1 CIN COUT CTTC CTTC1-CTTC5 = resistor:C-US: CAPACITOR, American symbol
C27_1812 = resistor:C-EU: CAPACITOR, European symbol
C34 C35 = resistor:CPOL-US: POLARIZED CAPACITOR, American symbol
D2 = SparkFun-LED:LED-GREEN: Various green LEDs 0603- DIO-00821 LARGE- DIO-00862 LILYPAD- DIO-09910; PROD_ID: DIO-00821
D3 = SparkFun-LED:LED-RED: Assorted Red LEDs LilyPad 1206- DIO-09912 1206- DIO-00809 0603- DIO-00819; PROD_ID: DIO-00819
D4 = diode:BAT54: Schottky Diodes Source: Fairchild .. BAT54.pdf
D6 = diode:1N5908: DIODE schottky
FET1 = transistor-power:FDN360P: Single P-Channel, PowerTrench (R) MOSFET Source: http://www.fairchildsemi.com/ds/FD/FDN360P.pdf
IC8 = texas:BQ24123: SINGLE-CHIP SWITCHMODE, LI-ION AND LI-POLYMER CHARGE-MANAGEMENT IC WITH ENHANCED EMI PERFORMANCE(bqSWITCHER) Source: www.ti.com .. TI-bq24125.pdf; MPN: BQ24123RHLT; OC_FARNELL: 1407131; OC_NEWARK: 84K0851
J1 J2 X4 = con-weidmueller-sl35:90-2: WEIDMUELLER CLAMP CONNECTOR; OC_FARNELL: unknown; OC_NEWARK: unknown
JP1 JP3-JP6 = jumper:JP1E: JUMPER
JP2 = SparkFun:M07: Header 7 Standard 7-pin 0.1" header. Use with straight break away headers (SKU : PRT-00116), right angle break away headers (PRT-00553), swiss pins (PRT-00743), machine pins (PRT-00117), and female headers (PRT-00115). NOTES ON THE VARIANTS LOCK and LOCK_LONGPADS... This footprint was designed to help hold the alignment of a through-hole component (i.e. 7-pin header) while soldering it into place. You may notice that each hole has been shifted either up or down by 0.005 of an inch from it's more standard position (which is usually a perfectly straight line). This slight alteration caused the pins (the squares in the middle) to touch the edges of the holes. Because they are alternating, it causes a "brace" to hold the header in place. 0.005 has proven to be the perfect amount of "off-center" position when using our standard breakaway headers. Although looks a little odd when you look at the bare footprint, once you have a header in there, the alteration is very hard to notice. Also, if you push a header all the way into place, it is covered up entirely on the bottom side. This idea of altering the position of holes to aid alignment will be further integrated into the Sparkfun Library for other footprints. It can help hold any component with 3 or more connection pins.
L1 L4 L7 = inductor-neosid:SM-1206: INDUCTOR SMD chip inductor; OC_FARNELL: unknown; OC_NEWARK: unknown
L2 = STM32F407_Rev_1:RCL_L-US: INDUCTOR, American symbol
L3 = inductors:DR73: High Power Density, High Efficiency, Shielded Inductors Source: coiltronics_dr_series.pdf
LED1-LED3 = led:SFH482: IR LED infrared emitting diode, Infineon
LED7 = ledIR:LED: LED OSRAM: - CHIPLED LG R971, LG N971, LY N971, LG Q971, LY Q971, LO R971, LY R971 LH N974, LH R974 LS Q976, LO Q976, LY Q976 LO Q996 - Hyper CHIPLED LW Q18S LB Q993, LB Q99A, LB R99A - SideLED LS A670, LO A670, LY A670, LG A670, LP A670 LB A673, LV A673, LT A673, LW A673 LH A674 LY A675 LS A676, LA A676, LO A676, LY A676, LW A676 LS A679, LY A679, LG A679 - Hyper Micro SIDELED® LS Y876, LA Y876, LO Y876, LY Y876 LT Y87S - SmartLED LW L88C, LW L88S LB L89C, LB L89S, LG L890 LS L89K, LO L89K, LY L89K LS L896, LA L896, LO L896, LY L896 - TOPLED LS T670, LO T670, LY T670, LG T670, LP T670 LSG T670, LSP T670, LSY T670, LOP T670, LYG T670 LG T671, LOG T671, LSG T671 LB T673, LV T673, LT T673, LW T673 LH T674 LS T676, LA T676, LO T676, LY T676, LB T676, LH T676, LSB T676, LW T676 LB T67C, LV T67C, LT T67C, LS T67K, LO T67K, LY T67K, LW E67C LS E67B, LA E67B, LO E67B, LY E67B, LB E67C, LV E67C, LT E67C LW T67C LS T679, LY T679, LG T679 LS T770, LO T770, LY T770, LG T770, LP T770 LB T773, LV T773, LT T773, LW T773 LH T774 LS E675, LA E675, LY E675, LS T675 LS T776, LA T776, LO T776, LY T776, LB T776 LHGB T686 LT T68C, LB T68C - Hyper Mini TOPLED® LB M676 - Mini TOPLED Santana® LG M470 LS M47K, LO M47K, LY M47K Source: http://www.osram.convergy.de LUXEON: - LUMILED® LXK2-PW12-R00, LXK2-PW12-S00, LXK2-PW14-U00, LXK2-PW14-V00 LXK2-PM12-R00, LXK2-PM12-S00, LXK2-PM14-U00 LXK2-PE12-Q00, LXK2-PE12-R00, LXK2-PE12-S00, LXK2-PE14-T00, LXK2-PE14-U00 LXK2-PB12-K00, LXK2-PB12-L00, LXK2-PB12-M00, LXK2-PB14-N00, LXK2-PB14-P00, LXK2-PB14-Q00 LXK2-PR12-L00, LXK2-PR12-M00, LXK2-PR14-Q00, LXK2-PR14-R00 LXK2-PD12-Q00, LXK2-PD12-R00, LXK2-PD12-S00 LXK2-PH12-R00, LXK2-PH12-S00 LXK2-PL12-P00, LXK2-PL12-Q00, LXK2-PL12-R00 Source: www.luxeon.com KINGBRIGHT: KA-3528ASYC Source: www.kingbright.com
MICROPHONE = SparkFun:M03: Header 3 Standard 3-pin 0.1" header. Use with straight break away headers (SKU : PRT-00116), right angle break away headers (PRT-00553), swiss pins (PRT-00743), machine pins (PRT-00117), and female headers (PRT-00115). Molex polarized connector foot print use with SKU : PRT-08232 with associated crimp pins and housings.
Q1 = special:XTAL/S: CRYSTAL
R1 R2 R7 R9 = rcl:R-EU_: RESISTOR, European symbol
R3 R10-R33 RI1-RI6 RSNS RT1 RT2 RTHERMAL = resistor:R-US_: RESISTOR, American symbol
R4 R8 = resistor:R-EU_: RESISTOR, European symbol
R5 R6 R34-R41 = SparkFun-Resistors:RESISTOR: Resistor Basic schematic elements and footprints for 0603, 1206, and PTH resistors.
S1-S8 = SparkFun:TAC_SWITCH: Momentary Switch Button commonly used for reset or general input. Spark Fun Electronics SKU : COM-00097
ST-LINK1 SV1 SV2 = con-lsta:FE05-1: FEMALE HEADER; OC_FARNELL: unknown; OC_NEWARK: unknown
SV3 = con-lsta:FE09-2: FEMALE HEADER; OC_FARNELL: unknown; OC_NEWARK: unknown
TPS61028 TPS63031 = ic-package:DIL10: Dual In Line / Socket
U1 = SparkFun-RF:BLUETOOTH-RN-52
U3 = zz1:BQ25504_RGT_16; DATASHEETURL: http://www.ti.com/lit/gpn/BQ25504; DESCRIPTION: Ultra Low Power Boost Converter with Battery Management for Energy Harvester App; FAMILY_NAME: BATTERY CHARGE MANAGEMENT; GENERIC_PART_NUMBER: BQ25504; INDUSTRY_STD_PKG_TYPE: QFN; MANUFACTURER: Texas Instruments; PACKAGE_DESIGNATOR: RGT; PIN_COUNT: 16
U4 = footprintfix:SRC4193_DB_28; DATASHEETURL: http://www.ti.com/lit/gpn/SRC4193; DESCRIPTION: High-End Sample Rate Converter; FAMILY_NAME: SAMPLE RATE CONVERTER; GENERIC_PART_NUMBER: SRC4193; INDUSTRY_STD_PKG_TYPE: SSOP; MANUFACTURER: Texas Instruments; MANUFACTURER_PART_NUMBER: src4193_db_28; PACKAGE_DESIGNATOR: DB; PIN_COUNT: 28; VENDOR: Texas Instruments
U5 = SparkFun:USD-SOCKET: microSD Socket Push-push type uSD socket. Schematic element and footprint production proven. Spark Fun Electronics SKU : PRT-00127. tDoc lines correctly indicate media card edge positions when inserting (unlocked, locked, depressed).
U$1 = ross:STM32F746
U$2 = qfn16:QFN16
XTAL1 = crystal:CRYSTAL: CRYSTAL; OC_FARNELL: 1666969; OC_NEWARK: unknown
XTAL3 = STM32F407_Rev_1:CRYSTAL_Q_GND

## Net classes
2 thin_power: width 0.254 mm
3 power usb: width 0.508 mm, drill 0.406 mm, clearance 0.203 mm